# EAGLE design BrickPi 0_7 (EAGLE 6.3)
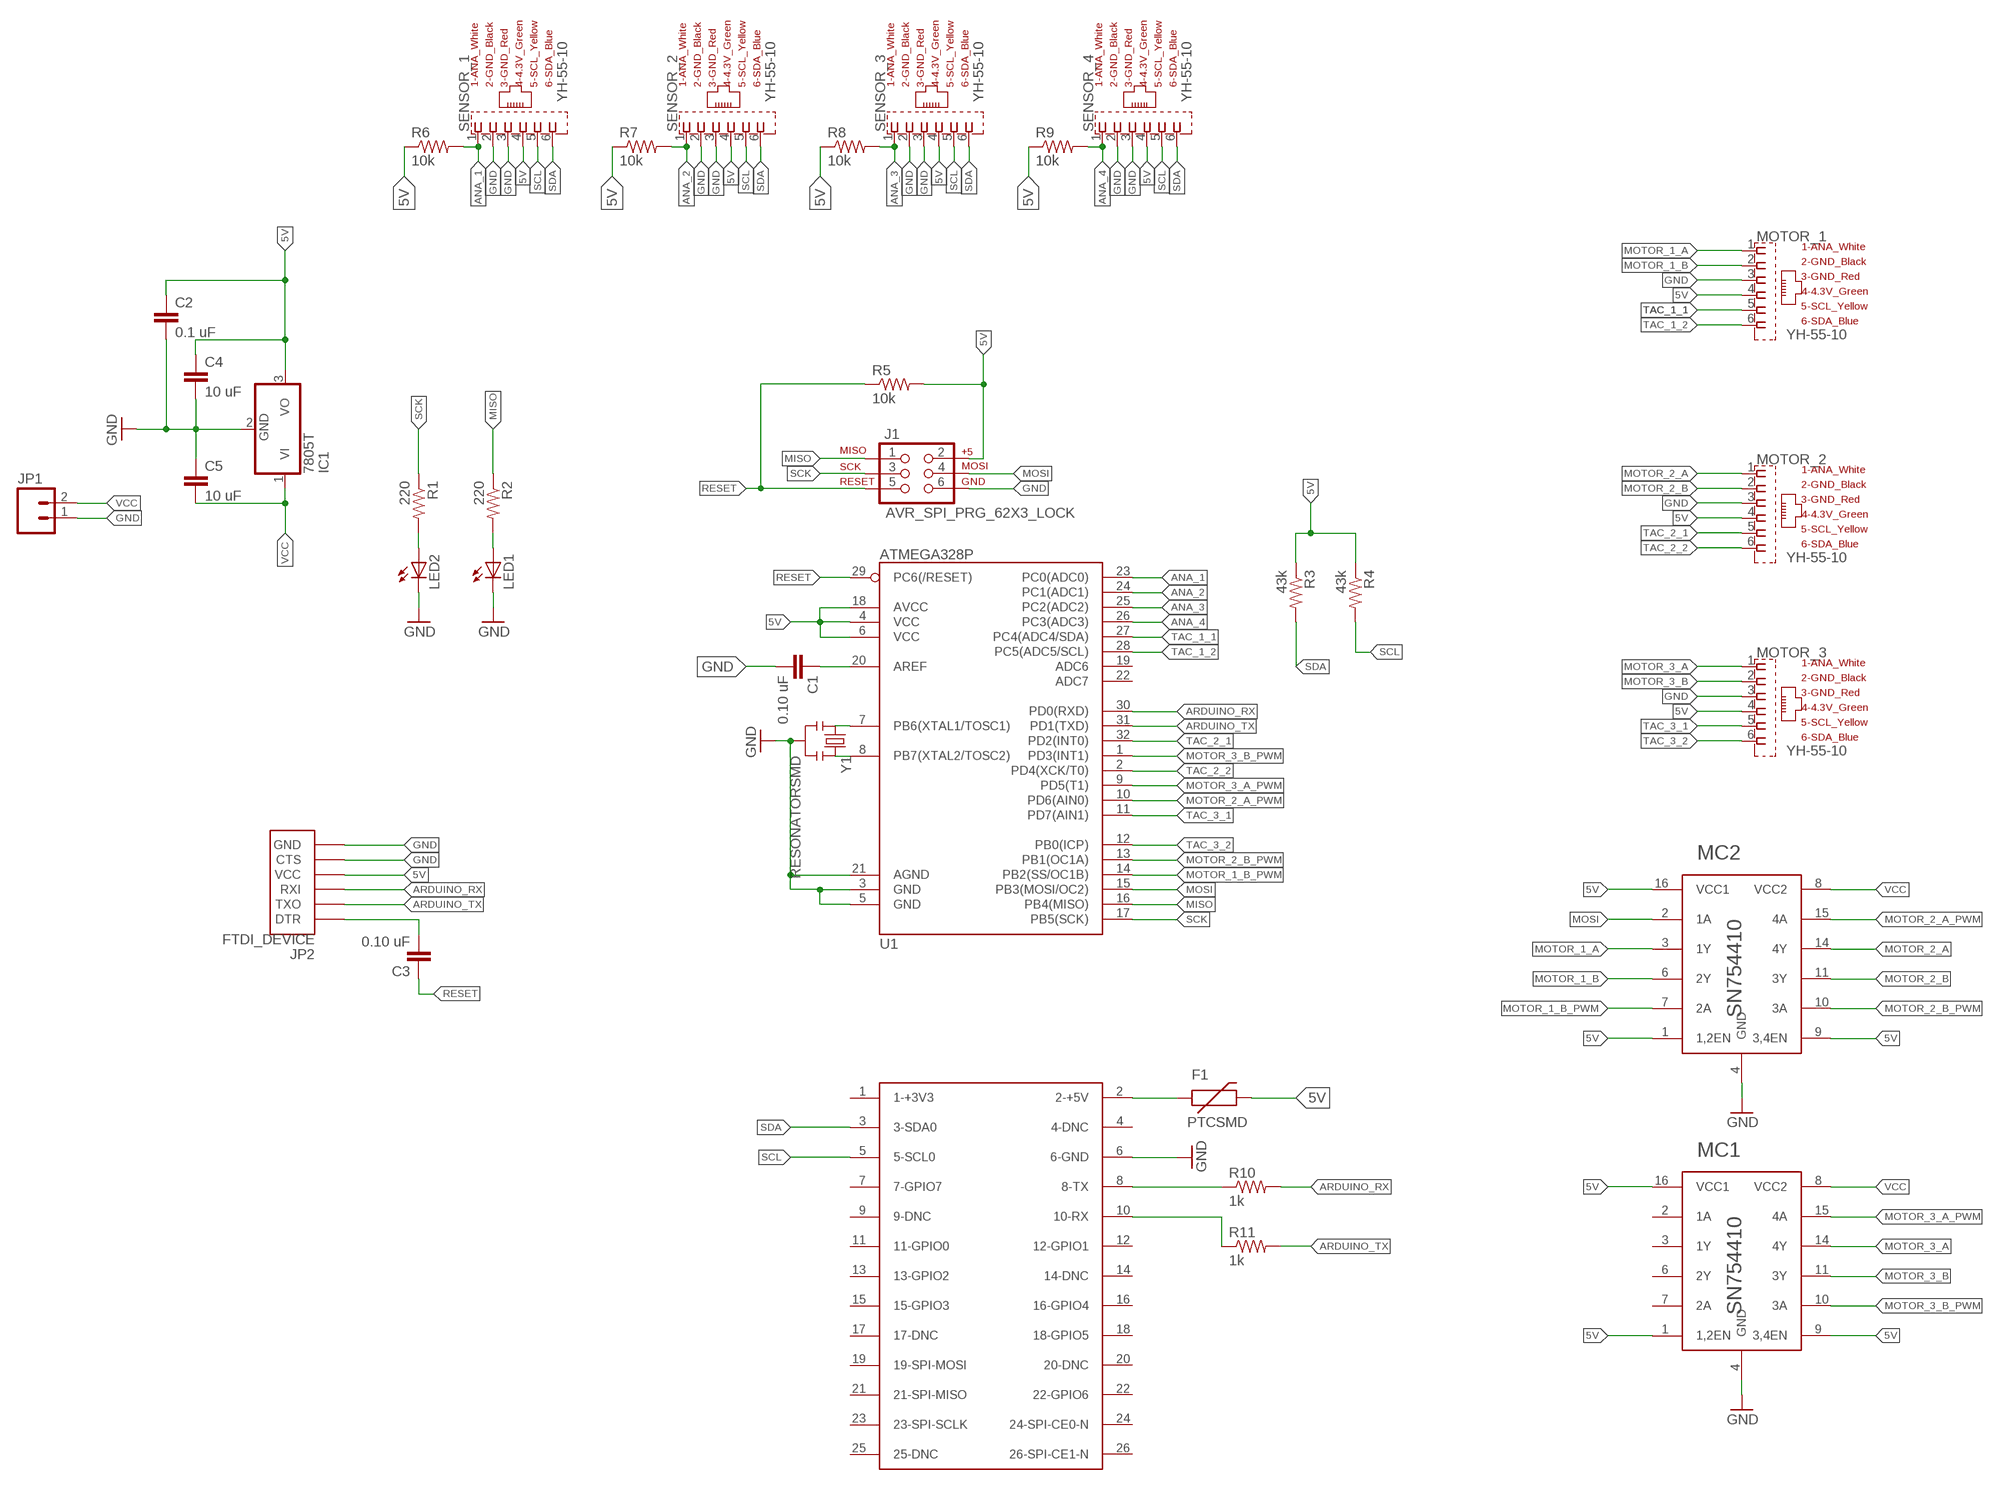
[diagram p0: schematic, sheet 1]

## Parts
C1  0.10 uF  CAP0805  [0805]
C2  0.1 uF  CAP0805  [0805]
C3  0.10 uF  CAP0805  [0805]
C4  10 uF  CAP0805  [0805]
C5  10 uF  CAP0805  [0805]
F1  PTCSMD  [PTC-1206]
IC1  7805T  [TO220H]
J1  AVR_SPI_PRG_62X3_LOCK  [2X3_LOCK]
JP1  M02LOCK  [1X02_LOCK]
JP2  FTDI_DEVICE  [FTDI_DEVICE_SIDE]
LED1  LED1206  [LED-1206]
LED2  LED1206  [LED-1206]
MC1  SN754410  [DIL16]
MC2  SN754410  [DIL16]
MOTOR_1  YH-55-10  [YH-55-10]
MOTOR_2  YH-55-10  [YH-55-10]
MOTOR_3  YH-55-10  [YH-55-10]
PI_OUTLINE  RASPBERRY-PI  [RASPBERRY-PI]
R1  220  220-5%  [0603-RES]
R2  220  220-5%  [0603-RES]
R3  43k  220-5%  [0603-RES]
R4  43k  220-5%  [0603-RES]
R5  10k  220-5%  [0603-RES]
R6  10k  220-5%  [0603-RES]
R7  10k  220-5%  [0603-RES]
R8  10k  220-5%  [0603-RES]
R9  10k  220-5%  [0603-RES]
R10  1k  220-5%  [0603-RES]
R11  1k  220-5%  [0603-RES]
SENSOR_1  YH-55-10  [YH-55-10]
SENSOR_2  YH-55-10  [YH-55-10]
SENSOR_3  YH-55-10  [YH-55-10]
SENSOR_4  YH-55-10  [YH-55-10]
U1  ATMEGA328P  ATMEGA328_SMT  [TQFP32-08]
Y1  RESONATORSMD  [RESONATOR-SMD]

## Nets
5V [Logic_Power]: C2.1 C4.1 F1.2 IC1.3(VO) J1.2 JP2.P$4(VCC) MC1.1(1,2EN) MC1.9(3,4EN) MC1.16(VCC1) MC2.1(1,2EN) MC2.9(3,4EN) MC2.16(VCC1) MOTOR_1.4(4_4.3V_GREEN) MOTOR_2.4(4_4.3V_GREEN) MOTOR_3.4(4_4.3V_GREEN) R3.1 R4.1 R5.2 R6.1 R7.1 R8.1 R9.1 SENSOR_1.4(4_4.3V_GREEN) SENSOR_2.4(4_4.3V_GREEN) SENSOR_3.4(4_4.3V_GREEN) SENSOR_4.4(4_4.3V_GREEN) U1.4(VCC) U1.6(VCC) U1.18(AVCC)
ANA_1: R6.2 SENSOR_1.1(1_ANA_WHITE) U1.23(PC0(ADC0))
ANA_2: R7.2 SENSOR_2.1(1_ANA_WHITE) U1.24(PC1(ADC1))
ANA_3: R8.2 SENSOR_3.1(1_ANA_WHITE) U1.25(PC2(ADC2))
ANA_4: R9.2 SENSOR_4.1(1_ANA_WHITE) U1.26(PC3(ADC3))
ARDUINO_RX: JP2.P$3(RXI) R10.2 U1.30(PD0(RXD))
ARDUINO_TX: JP2.P$2(TXO) R11.2 U1.31(PD1(TXD))
GND [Power]: C1.2 C2.2 C4.2 C5.1 IC1.2(GND) J1.6 JP1.1 JP2.P$5(CTS) JP2.P$6(GND) LED1.C LED2.C MC1.4(GND) MC2.4(GND) MOTOR_1.3(3_GND_RED) MOTOR_2.3(3_GND_RED) MOTOR_3.3(3_GND_RED) PI_OUTLINE.6(6-GND) SENSOR_1.2(2_GND_BLACK) SENSOR_1.3(3_GND_RED) SENSOR_2.2(2_GND_BLACK) SENSOR_2.3(3_GND_RED) SENSOR_3.2(2_GND_BLACK) SENSOR_3.3(3_GND_RED) SENSOR_4.2(2_GND_BLACK) SENSOR_4.3(3_GND_RED) U1.3(GND) U1.5(GND) U1.21(AGND) Y1.2
MISO: J1.1 R2.1 U1.16(PB4(MISO))
MOSI: J1.4 MC2.2(1A) U1.15(PB3(MOSI/OC2))
MOTOR_1_A [Power]: MC2.3(1Y) MOTOR_1.1(1_ANA_WHITE)
MOTOR_1_B [Power]: MC2.6(2Y) MOTOR_1.2(2_GND_BLACK)
MOTOR_1_B_PWM: MC2.7(2A) U1.14(PB2(SS/OC1B))
MOTOR_2_A [Power]: MC2.14(4Y) MOTOR_2.1(1_ANA_WHITE)
MOTOR_2_A_PWM: MC2.15(4A) U1.10(PD6(AIN0))
MOTOR_2_B [Power]: MC2.11(3Y) MOTOR_2.2(2_GND_BLACK)
MOTOR_2_B_PWM: MC2.10(3A) U1.13(PB1(OC1A))
MOTOR_3_A [Power]: MC1.14(4Y) MOTOR_3.1(1_ANA_WHITE)
MOTOR_3_A_PWM: MC1.15(4A) U1.9(PD5(T1))
MOTOR_3_B [Power]: MC1.11(3Y) MOTOR_3.2(2_GND_BLACK)
MOTOR_3_B_PWM: MC1.10(3A) U1.1(PD3(INT1))
N$1: U1.7(PB6(XTAL1/TOSC1)) Y1.1
N$2: U1.8(PB7(XTAL2/TOSC2)) Y1.3
N$3: LED2.A R1.2
N$4: LED1.A R2.2
N$6 [Logic_Power]: C1.1 U1.20(AREF)
N$14: C3.2 JP2.P$1(DTR)
PI_POWER: F1.1 PI_OUTLINE.2(2-+5V)
RESET: C3.1 J1.5 R5.1 U1.29(PC6(/RESET))
RX_TO_PI: PI_OUTLINE.8(8-TX) R10.1
SCK: J1.3 R1.1 U1.17(PB5(SCK))
SCL: PI_OUTLINE.5(5-SCL0) R4.2 SENSOR_1.5(5_SCL_YELLOW) SENSOR_2.5(5_SCL_YELLOW) SENSOR_3.5(5_SCL_YELLOW) SENSOR_4.5(5_SCL_YELLOW)
SDA: PI_OUTLINE.3(3-SDA0) R3.2 SENSOR_1.6(6_SDA_BLUE) SENSOR_2.6(6_SDA_BLUE) SENSOR_3.6(6_SDA_BLUE) SENSOR_4.6(6_SDA_BLUE)
TAC_1_1: MOTOR_1.5(5_SCL_YELLOW) U1.27(PC4(ADC4/SDA))
TAC_1_2: MOTOR_1.6(6_SDA_BLUE) U1.28(PC5(ADC5/SCL))
TAC_2_1: MOTOR_2.5(5_SCL_YELLOW) U1.32(PD2(INT0))
TAC_2_2: MOTOR_2.6(6_SDA_BLUE) U1.2(PD4(XCK/T0))
TAC_3_1: MOTOR_3.5(5_SCL_YELLOW) U1.11(PD7(AIN1))
TAC_3_2: MOTOR_3.6(6_SDA_BLUE) U1.12(PB0(ICP))
TX_TO_PI: PI_OUTLINE.10(10-RX) R11.1
VCC [Power]: C5.2 IC1.1(VI) JP1.2 MC1.8(VCC2) MC2.8(VCC2)
Unconnected: MC1.2(1A) MC1.3(1Y) MC1.6(2Y) MC1.7(2A) PI_OUTLINE.1(1-+3V3) PI_OUTLINE.4(4-DNC) PI_OUTLINE.7(7-GPIO7) PI_OUTLINE.9(9-DNC) PI_OUTLINE.11(11-GPIO0) PI_OUTLINE.12(12-GPIO1) PI_OUTLINE.13(13-GPIO2) PI_OUTLINE.14(14-DNC) PI_OUTLINE.15(15-GPIO3) PI_OUTLINE.16(16-GPIO4) PI_OUTLINE.17(17-DNC) PI_OUTLINE.18(18-GPIO5) PI_OUTLINE.19(19-SPI-MOSI) PI_OUTLINE.20(20-DNC) PI_OUTLINE.21(21-SPI-MISO) PI_OUTLINE.22(22-GPIO6) PI_OUTLINE.23(23-SPI-SCLK) PI_OUTLINE.24(24-SPI-CE0-N) PI_OUTLINE.25(25-DNC) PI_OUTLINE.26(26-SPI-CE1-N) U1.19(ADC6) U1.22(ADC7)

## Power pins joined to a net without a drawn wire
GND: MC1.5(GND) MC1.12(GND) MC1.13(GND) MC2.5(GND) MC2.12(GND) MC2.13(GND)

## Library data of the parts
C1-C5 = SparkFun:CAP: Capacitor Standard 0603 ceramic capacitor, and 0.1" leaded capacitor.
F1 = SparkFun-PowerIC:PTC: Resettable Fuse PTC Resettable Fuse. Spark Fun Electronics SKU : COM-08357
IC1 = linear:78*: Positive VOLTAGE REGULATOR Source: http://cache.national.com/ds/LM/LM78L05.pdf http://www.fairchildsemi.com/ds/LM/LM7805.pdf
J1 = SparkFun-Connectors:AVR_SPI_PRG_6: AVR ISP 6 Pin This is the reduced ISP connector for AVR programming. Common on Arduino. This footprint will take up less PCB space and can be used with a 10-pin to 6-pin adapter such as SKU: BOB-08508
JP1 = SparkFun-f115009:M02: Header 2 Standard 2-pin 0.1" header. Use with straight break away headers (SKU : PRT-00116), right angle break away headers (PRT-00553), swiss pins (PRT-00743), machine pins (PRT-00117), and female headers (PRT-00115). Molex polarized connector foot print use with SKU : PRT-08233 with associated crimp pins and housings.
JP2 = SparkFun-Connectors:FTDI_DEVICE: Connector which mates to FTDI basic or FTDI cable.
LED1 LED2 = SparkFun-LED:LED: LEDs Standard schematic elements and footprints for 5mm, 3mm, 1206, and 0603 sized LEDs. 5mm - Spark Fun Electronics SKU : COM-00529 (and others)
MC1 MC2 = DualBridge:SN754410: Quad Half-Bridge Driver
MOTOR_1-MOTOR_3 SENSOR_1-SENSOR_4 = DEXTER INDUSTRIES NXT Female Adapter (2!!):YH-55-10: RJ11 6 connects Source:Dexter Industries LEGO MINDSTORMS NXT Female Adapter; OC_FARNELL: unknown; OC_NEWARK: unknown
PI_OUTLINE = RaspberryPi:RASPBERRY-PI: Raspberry Pi Board <http://www.raspberrypi.org/> Jacques Lagnel V1.0 (beta) 2012 Board dimension: Forum 3D model <http://www.raspberrypi.org/forum/general-discussion/mechanical-profile-3d-models?value=3d%20model&type=1&include=1&search=1&ret=all> The GPIO Connector (P1): http://elinux.org/RPi_Low-level_peripherals
R1 R2 = SparkFun-Resistors:220-5%: 220-ohm SMT 1/8W - 5% (0805) RES-07866; PROD_ID: RES-07866
R3-R11 = SparkFun-Resistors:220-5%: 220-ohm SMT 1/8W - 5% (0805) RES-07866; PROD_ID: RES-07866; VALUE: 220
U1 = SparkFun-DigitalIC:ATMEGA328_SMT: 32-Pin Atmega328 part Commonly used on Arduino compatible boards Available in QFP and QFN packages TQFP is IC-09069 QFN is non-stock; PROD_ID: IC-09069
Y1 = SparkFun-f115009:RESONATOR: Resonator Small SMD resonator. This is the itty bitty 10/20MHz resonators with built in caps. CSTCE10M0G55 and CSTCE20M0V53. Footprint has been reviewed closely but hasn't been tested yet.

## Net classes
0 DATA: width 0.254 mm, drill 0.5 mm, clearance 0.152 mm
1 Power: width 0.508 mm, drill 0.6 mm, clearance 0.152 mm
2 Logic_Power: width 0.381 mm, drill 0.6 mm, clearance 0.152 mm

## Board
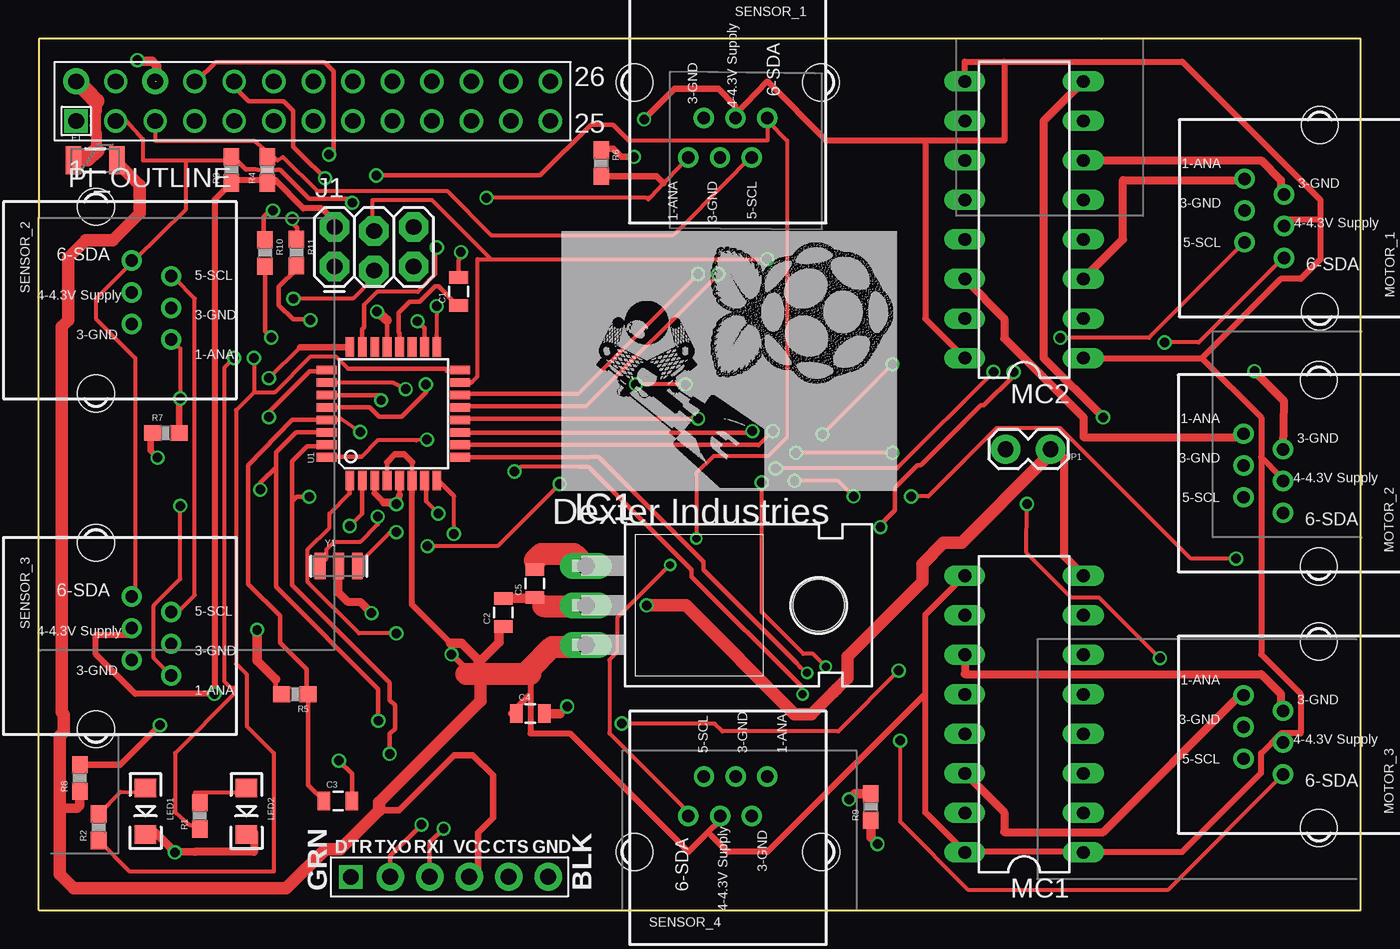
[diagram p1: board, top side]
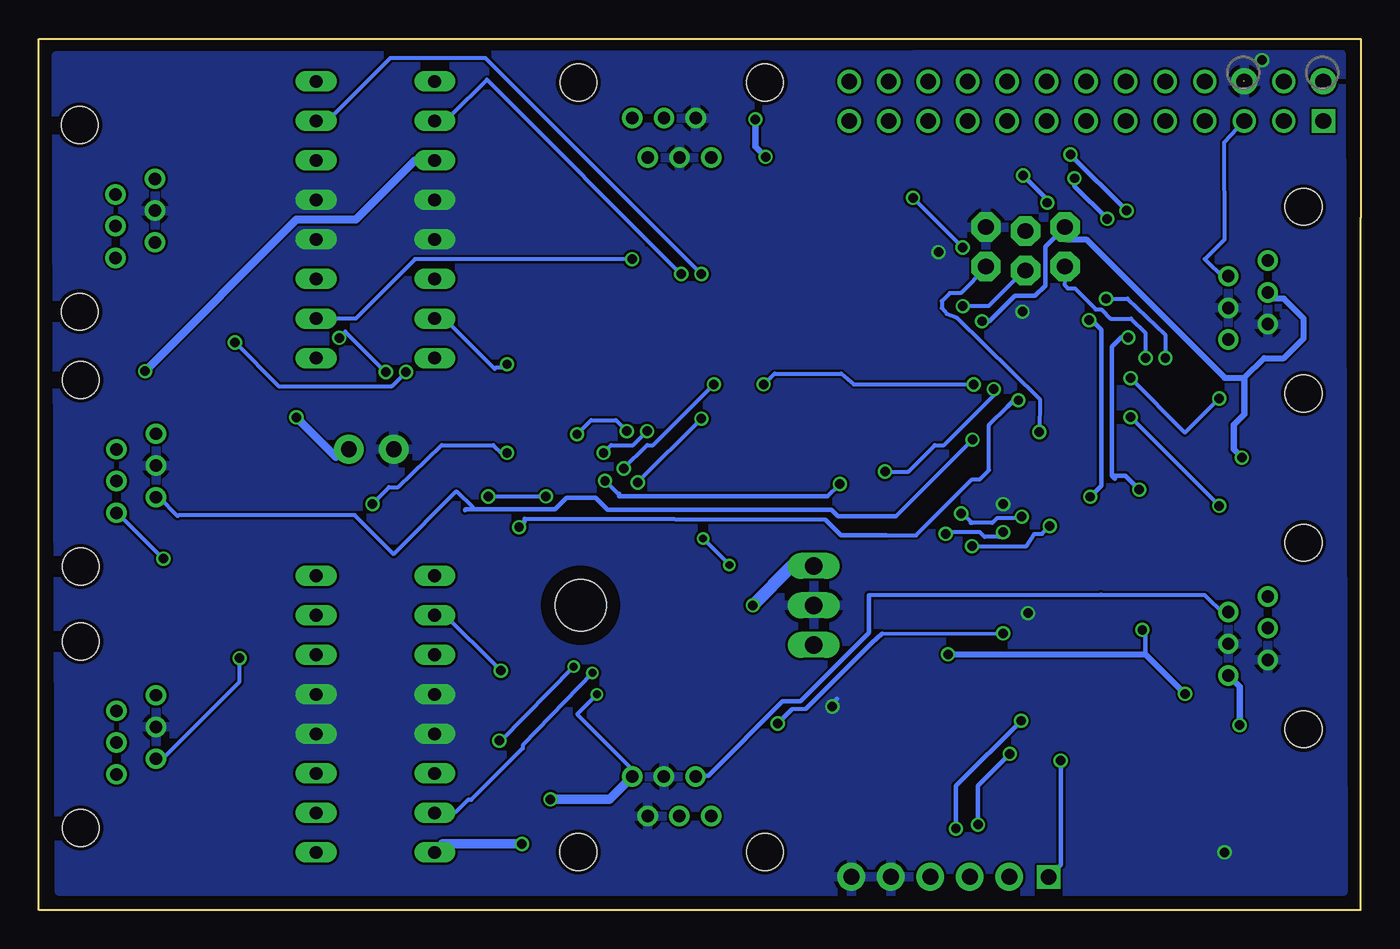
[diagram p2: board, bottom side, seen from below]

Size 85 x 56 mm. Coordinates in mm from the lower left corner, seen from the top.
Copper layers (1*16): Top 0.035mm / dielectric 1.5mm / Bottom 0.035mm
Design rules "Fusion_eagle_rule_v1.1": minimum track width 6mil, minimum drill 12mil, track to track 6mil, track to pad 6mil, pad to pad 6mil, via to via 6mil, smd to smd 0mil, copper to edge 10mil, drill to drill 10mil, minimum pad ring 10mil, minimum via ring 6mil, stop-mask expansion 2mil, vias tented up to drill 100mil, thermal gap 10mil

### Footprints (pad centres in the part's own frame; a part is rotated, then mirrored left to right if it is on the bottom)
0805 = smd 0.8 x 1.2: 1 -0.9,0; 2 0.9,0
PTC-1206 = smd 1 x 1.8: 1 -1.4,0; 2 1.4,0
TO220H = drill 1.118 long: 1 -2.54,-10.16; 2 0,-10.16; 3 2.54,-10.16 | hole 3.302: 0,4.826
2X3_LOCK = drill 1.016 pad 1.88 octagon: 1 0,0; 2 0,2.54; 3 2.54,-0.254; 4 2.54,2.286; 5 5.08,0; 6 5.08,2.54
1X02_LOCK = drill 1.016 pad 1.88: 1 -0.178,0; 2 2.718,0
FTDI_DEVICE_SIDE = drill 1 square: P$1 -6.35,0 | drill 1.016 pad 1.778: P$2 -3.81,0; P$3 -1.27,0; P$4 1.27,0; P$5 3.81,0; P$6 6.35,0
LED-1206 = smd 1.2 x 1.4: A -1.5,0; C 1.5,0
DIL16 = drill 0.813 long: 1 -8.89,-3.81; 2 -6.35,-3.81; 3 -3.81,-3.81; 4 -1.27,-3.81; 5 1.27,-3.81; 6 3.81,-3.81; 7 6.35,-3.81; 8 8.89,-3.81; 9 8.89,3.81; 10 6.35,3.81; 11 3.81,3.81; 12 1.27,3.81; 13 -1.27,3.81; 14 -3.81,3.81; 15 -6.35,3.81; 16 -8.89,3.81
YH-55-10 = drill 0.8 pad 1.3: 1 2.54,4.84; 2 1.54,2.3; 3 0.5,4.84; 4 -0.5,2.3; 5 -1.54,4.84; 6 -2.54,2.3 | hole 2.36: -6,0; 6,0
RASPBERRY-PI = drill 1 square: 1 0,0 | drill 1 pad 1.676: 2 0,2.54; 6 5.08,2.54 | drill 1: 3 2.54,0; 4 2.54,2.54; 5 5.08,0; 7 7.62,0; 8 7.62,2.54; 9 10.16,0; 10 10.16,2.54; 11 12.7,0; 12 12.7,2.54; 13 15.24,0; 14 15.24,2.54; 15 17.78,0; 16 17.78,2.54; 17 20.32,0; 18 20.32,2.54; 19 22.86,0; 20 22.86,2.54; 21 25.4,0; 22 25.4,2.54; 23 27.94,0; 24 27.94,2.54; 25 30.48,0; 26 30.48,2.54
0603-RES = smd 1.1 x 1: 1 -0.85,0; 2 0.85,0
TQFP32-08 = smd 1.27 x 0.559: 1 -4.293,2.8; 2 -4.293,2; 3 -4.293,1.2; 4 -4.293,0.4; 5 -4.293,-0.4; 6 -4.293,-1.2; 7 -4.293,-2; 8 -4.293,-2.8; 17 4.293,-2.8; 18 4.293,-2; 19 4.293,-1.2; 20 4.293,-0.4; 21 4.293,0.4; 22 4.293,1.2; 23 4.293,2; 24 4.293,2.8 | smd 0.559 x 1.27: 9 -2.8,-4.293; 10 -2,-4.293; 11 -1.2,-4.293; 12 -0.4,-4.293; 13 0.4,-4.293; 14 1.2,-4.293; 15 2,-4.293; 16 2.8,-4.293; 25 2.8,4.293; 26 2,4.293; 27 1.2,4.293; 28 0.4,4.293; 29 -0.4,4.293; 30 -1.2,4.293; 31 -2,4.293; 32 -2.8,4.293
RESONATOR-SMD = smd 0.7 x 1.7: 1 -1.2,0; 2 0,0; 3 1.2,0

### Placement (x,y rotation side)
C1  26.99,39.75 90 top
C2  29.86,19.13 90 top
C3  19.24,7.01 0 top
C4  31.61,12.62 0 top
C5  31.89,20.98 90 top
F1  3.62,48.18 0 top
IC1  45.33,19.58 270 top
J1  19.01,41.36 0 top
JP1  62.35,29.62 0 top
JP2  26.4,2.13 0 top
LED1  6.86,6.34 270 top
LED2  13.35,6.34 270 top
MC1  63.36,12.59 90 top
MC2  63.36,44.38 90 top
MOTOR_1  82.37,44.46 90 top
MOTOR_2  82.31,28.07 90 top
MOTOR_3  82.31,11.26 90 top
PI_OUTLINE  2.4,50.73 0 top
R1  10.34,6.05 90 top
R2  3.85,5.32 90 top
R3  12.39,47.59 90 top
R4  14.69,47.59 90 top
R5  16.47,13.87 180 top
R6  36.16,48.01 270 top
R7  8.17,30.66 0 top
R8  2.63,8.48 90 top
R9  53.5,6.63 90 top
R10  14.54,42.24 270 top
R11  16.57,42.27 270 top
SENSOR_1  44.3,53.2 180 top
SENSOR_2  3.67,39.2 270 top
SENSOR_3  3.67,17.61 270 top
SENSOR_4  44.31,3.73 0 top
U1  22.8,31.91 90 top
Y1  19.28,22.1 0 top

### Tracks (layer width: path | path; a pad name or v marks a point on that pad's centre or on a via)
5V  (via drill 0.6, 0.61)
  Top 0.305: 23.99,28.78 23.99,27.86 U1.6 | v24.35,37.85 24.8,37.39 U1.18 | 22.39,28.78 U1.4 | 15.23,14.83 15.23,14.26 R5.2
  Top 0.381: 15.23,46.91 12.56,46.91 | 15.23,46.91 17,45.11 18.2,45.11 18.91,44.38 J1.2 | 15.23,46.91 R4.1 | 12.56,46.91 11.29,45.64 v11.29,13.89 6.21,13.89 3.67,16.43 3.67,17.7 6.21,17.7 SENSOR_3.4 | 12.56,46.91 R3.1 | 26.48,17.15 23.99,19.63 23.99,27.86 U1.6 | 31.61,13.89 30.34,12.62 C4.1 | 31.61,15.16 31.61,13.89 | 43.04,5 41.77,3.73 34.15,11.35 31.61,11.35 31.61,13.89 | 43.04,5 43.8,5.74 SENSOR_4.4 | 79.87,11.35 78.6,10.08 78.6,8.81 73.52,3.73 67.17,3.73 | 67.17,3.73 59.55,3.73 | 67.17,3.73 MC1.1 | 57.01,13.89 57.01,6.27 59.55,3.73 | 57.01,13.89 57.01,18.97 59.55,21.51 MC1.9 | 59.55,3.73 MC1.16 | 78.6,29.13 79.87,27.86 MOTOR_2.4 | 78.6,29.13 78.6,31.67 74.79,35.48 | MC2.1 74.79,35.48 | 82.41,44.38 79.87,44.38 MOTOR_1.4 | 82.41,44.38 82.41,45.64 73.52,54.53 62.09,54.53 | 62.09,54.53 59.55,54.53 MC2.9 | 57.01,49.45 62.09,49.45 62.09,54.53 | 57.01,49.45 50.66,49.45 46.85,53.27 44.77,51.11 SENSOR_1.4 | MC2.16 57.01,38.02 57.01,49.45 | 74.79,35.48 79.87,40.56 81.14,40.56 82.41,41.84 82.41,44.38 | 79.87,11.35 81.14,11.35 81.14,13.89 78.6,16.43 78.6,29.13 | 79.87,11.35 MOTOR_3.4 | 43.04,5 44.28,3.73 46.85,3.73 57.01,13.89
  Top 0.406: 22.39,28.78 22.89,29.28 23.49,29.28 23.99,28.78 | U1.6 | v26.53,16.43 26.55,16.43 27.82,15.16 | 44.77,51.11 44.77,51.72 43.7,52.78 40.88,52.78 v38.92,50.83 | v38.27,48.41 37.48,48.41 36.97,48.92 36.22,48.92 R6.1 | v7.63,29.08 7.61,29.08 7.18,29.52 7.18,30.52 R7.1 | 21.88,6.43 23.18,6.43 26.71,9.96 27.9,9.96 29.2,8.66 29.2,5.94 28.23,4.98 28.23,2.69 JP2.P$4
  Top 0.61: R8.1 2.63,6.71 2.45,6.53 1.36,6.53 1.33,6.55 | 26.48,17.15 27.19,17.15 28.26,16.08 | 28.26,16.08 28.26,15.19 28.23,15.16 | 28.26,16.08 28.46,16.08 29.6,17.22 29.6,17.97 C2.1 | R9.1 53.5,4.67 v53.94,4.24 | v14.03,18.01 14.03,16.03 15.23,14.83
  Top 0.813: F1.2 5.02,48.05 6.49,46.59 6.49,44.81 4.74,43.05 3.01,43.05 1.89,41.94 1.89,37.92 1.46,37.49 1.46,12.7 1.61,12.55 1.61,11.46 1.33,11.18 1.33,6.55 1.33,2.31 2.25,1.4 15.91,1.4 18.43,3.91 19.37,3.91 21.88,6.43 21.88,6.93 28.41,13.46 28.41,15.16
  Top 1.422: IC1.3 35.04,16.92 33.01,16.92 31.61,15.52 31.61,15.16 28.41,15.16 28.23,15.16 27.82,15.16 27.48,15.16
  Bottom 0.305: v24.35,37.85 23.86,37.85 22.24,39.47 20.94,39.47 20.28,40.13 20.28,42.63 J1.2 | 13.83,16.43 13.83,17.81 v14.03,18.01
  Bottom 0.381: SENSOR_2.4 6.21,39.29 4.94,39.29 3.67,38.02 3.67,36.75 4.94,35.48 6.21,35.48 7.48,34.21 8.75,34.21 17.64,43.1 18.91,43.1 J1.2 | v11.29,13.89 13.83,16.43 v26.53,16.43
  Bottom 0.406: v38.92,50.83 38.92,49.07 v38.27,48.41 | 7.48,34.21 7.48,31.88 8.17,31.19 8.17,29.62 v7.63,29.08
  Bottom 0.61: v53.94,4.24 59.04,4.24 59.17,4.12 59.17,4.09 MC1.16
ANA_1  (via drill 0.61)
  Top 0.254: 20.91,38.9 21.75,39.74 24.37,39.74 25.49,40.88 25.49,42.48 v25.59,42.59 | v28.79,45.78 39.09,45.78 39.19,45.68 39.19,45.78 39.29,45.78 40.17,46.7 41.29,47.88 41.69,48.28 SENSOR_1.1
  Top 0.305: 20.91,38.9 20.91,37.46 20.79,37.34 20.79,36.21 U1.23
  Top 0.406: R6.2 39.71,47.16 40.17,46.7
  Bottom 0.254: v28.79,45.78 v25.59,42.59
ANA_2  (via drill 0.61)
  Top 0.254: v14.79,34.18 16.79,36.18 | v9.09,32.88 9.09,36.09 SENSOR_2.1 | U1.24
  Top 0.406: R7.2 9.02,32.81 v9.09,32.88 | 16.79,36.18 19.99,36.18 U1.24
  Bottom 0.254: v14.79,34.18 11.29,30.68 v9.09,32.88
ANA_3  (via drill 0.6, 0.61)
  Top 0.254: v9.09,25.98 9.09,21.28 7.39,19.58 7.39,16.18 8.49,15.08 SENSOR_3.1
  Top 0.305: v14.79,31.68 14.79,32 17.41,34.62 18.42,34.62 U1.25
  Top 0.406: R8.2 5.23,9.33 v7.79,11.89
  Bottom 0.254: v9.09,25.98 v14.79,31.68
  Bottom 0.406: v7.79,11.89 7.79,14.35 SENSOR_3.1
ANA_4  (via drill 0.5, 0.6, 0.61)
  Top 0.254: v23.59,33.48 22.79,33.88 18.59,33.88 U1.26 | 34.69,28.48 30.99,28.48 v30.59,28.18 | v49.11,13.86 49.01,14.4
  Top 0.305: 34.69,28.48 35.36,28.48 41.97,21.87 41.97,21.41 49.01,14.4 48.96,14.4
  Top 0.61: R9.2 52.47,7.48 v52.11,7.11
  Bottom 0.254: v30.59,28.18 29.09,28.18 27.39,29.88 26.79,29.88 23.59,33.09 v23.59,33.48 | 46.79,9.08 46.79,8.58 SENSOR_4.1 46.89,9.08 50.39,12.58 v49.11,13.86
  Bottom 0.61: v52.11,7.11 48.31,7.11 SENSOR_4.1
ARDUINO_RX  (via drill 0.6)
  Top 0.305: JP2.P$3 25.13,4.34 v26.02,5.23 | v21.83,12.17 21.83,14.2 15.25,20.78 15.25,28.47 | 15.25,28.47 15.25,29.41 16.55,30.71 U1.30 | R10.2 14.54,37.21 v14.95,36.81 | v14.24,27.03 14.24,27.46 15.25,28.47
  Bottom 0.305: v26.02,5.23 26.02,7.98 v21.83,12.17 | v14.95,36.81 15.38,36.81 15.99,36.2 15.99,27.92 | 15.99,27.92 15.81,27.74 | 15.99,27.92 15.12,27.92 v14.24,27.03
ARDUINO_TX  (via drill 0.6)
  Top 0.305: JP2.P$2 22.59,3.48 v24.6,5.49 | v22.57,10.03 22.57,11.33 22.9,11.66 22.9,13.16 22.57,13.49 22.57,14.61 16.29,20.88 16.29,26.29 | 16.29,26.29 16.29,28.86 17.26,29.82 18.42,29.82 U1.31 | R11.2 16.57,41.2 15.43,40.06 15.43,38.89 16.34,37.97 17.41,37.97 v17.46,37.92 | v17.39,26.57 16.57,26.57 16.29,26.29
  Bottom 0.305: v24.6,5.49 24.6,8 v22.57,10.03 | v17.46,37.92 17.28,37.92 16.68,37.31 16.68,27.28 v17.39,26.57
GND  (via drill 0.6, 0.61)  (1 unrouted)
  Top 0.305: 23.19,26.68 23.19,27.58 | C1.2 26.99,41.73 v27.14,42.29 | 33.52,12.62 v33.97,13.08 | 22.39,37.9 22.39,36.21 U1.21 | 21.59,27.58 21.59,26.78
  Top 0.406: v22.99,26.08 23.19,26.68 | 22.19,26.18 21.59,26.78
  Top 0.508: LED1.C 7.48,5 v8.75,3.7 10.02,3.73 13.83,3.73 13.83,5 LED2.C | 23.19,27.58 U1.5 | 22.19,26.18 22.59,26.18 v22.99,26.08 | 21.59,27.58 U1.3 | v21.39,19.08 20.69,19.78 19.89,19.78 19.29,20.38 19.29,22.28 19.19,22.18 Y1.2
  Top 0.61: v21.75,38.46 22.39,37.9 | C4.2 33.52,12.62 | C2.2 31.83,20.03 C5.1 | 6.67,54.56 7.3,54.56 7.58,54.28 7.58,53.34 7.53,53.29
  Top 0.813: C5.1 32.45,19.53
  Top 1.422: 32.45,19.53 35.11,19.53 IC1.2
  Bottom 0.305: v27.14,42.29 27.01,42.32 27.19,42.49 | v33.97,13.08 33.97,13.28 33.67,13.59
  other vias: 6.34,54.64
  pour Bottom: 1.23,55 83.88,54.91 83.68,1.19 1.13,1.19
MISO  (via drill 0.61)
  Top 0.254: v13.83,35.48 13.83,33.28 | 13.83,33.28 12.69,32.14 12.69,15.82 13.37,15.14 13.37,11.81 15.1,10.08 15.1,2.46 5.85,2.46 R2.1 | 19.89,34.78 19.09,35.59 17.49,35.59 15.19,33.28 13.83,33.28 | 27.09,34.78 U1.16
  Top 0.305: 19.89,34.78 26.11,34.78 26.23,34.67 27.06,34.67 U1.16
  Bottom 0.254: v13.83,35.48 13.86,37.11 14.77,38.02 16.09,38.02 16.68,38.61 17.03,38.61 18.38,39.95 18.83,39.95 19.04,40.21 19.01,40.51 J1.1
MOSI  (via drill 0.61)
  Top 0.254: 29.07,41.84 28.19,41.84 28.19,34.28 27.89,33.98 | 29.07,41.84 v46.85,41.84 | 29.07,41.84 25.26,45.64 21.45,45.64 21.45,44.38 J1.4
  Top 0.305: U1.15 27.81,33.91 27.89,33.98
  Bottom 0.254: MC2.2 64.63,38.02 60.82,41.84 v46.85,41.84
MOTOR_1_A
  Top 0.508: MC2.3 69.71,43.1 69.71,46.91 77.33,46.91 MOTOR_1.1
MOTOR_1_B
  Top 0.508: MC2.6 78.6,48.18 79.87,46.91 79.87,45.64 MOTOR_1.2
MOTOR_1_B_PWM  (via drill 0.61)
  Top 0.254: v42.39,40.88 34.69,33.18 | 27.19,33.18 U1.14
  Top 0.305: 27.19,33.18 34.69,33.18
  Bottom 0.254: v42.39,40.88 56.29,54.78 62.39,54.78 66.09,51.09 66.79,51.09 67.09,50.78 MC2.7
MOTOR_2_A
  Top 0.508: MC2.14 62.09,38.02 62.09,36.75 67.17,31.67 67.17,30.41 77.33,30.41 MOTOR_2.1
MOTOR_2_A_PWM  (via drill 0.6, 0.61)
  Top 0.254: v47.19,30.78 46.29,29.88 | v54.89,35.09 v50.39,30.59
  Top 0.305: U1.10 46.27,29.91 46.29,29.88
  Bottom 0.254: v47.19,30.78 47.89,31.48 49.49,31.48 v50.39,30.59 | v54.89,35.09 54.89,34.98 54.79,34.88 55.59,34.88 55.69,34.78 59.19,38.28 59.49,37.98 MC2.15
MOTOR_2_B  (via drill 0.6)
  Top 0.508: v78.17,34.64 80.07,32.73 MOTOR_2.2
  Bottom 0.508: v78.17,34.64 68.44,44.38 64.63,44.38 60.82,48.18 MC2.11
MOTOR_2_B_PWM  (via drill 0.61)
  Top 0.254: v43.69,40.88 35.19,32.38 | 27.19,32.38 U1.13
  Top 0.305: 27.19,32.38 35.19,32.38
  Bottom 0.254: v43.69,40.88 56.19,53.38 58.49,51.09 59.19,51.09 MC2.10
MOTOR_3_A
  Top 0.508: MOTOR_3.1 77.33,13.89 68.44,5 62.09,5 62.09,6.27 59.55,8.81 MC1.14
MOTOR_3_A_PWM  (via drill 0.5)
  Top 0.254: v49.4,15.25 48.96,15.62
  Top 0.305: 48.96,15.62 48.75,15.85 42.73,21.87 42.73,22.38 35.98,29.13 35.5,29.13 35.47,29.1 U1.9
  Bottom 0.254: MC1.15 59.55,6.27 58.28,6.27 58.19,6.28 57.39,7.08 57.19,7.08 53.89,10.38 53.89,10.58 v49.4,15.25
MOTOR_3_B
  Top 0.508: MOTOR_3.2 79.87,12.62 79.87,13.89 78.6,15.16 59.55,15.16 MC1.11 59.55,16.43
MOTOR_3_B_PWM  (via drill 0.61)
  Top 0.254: 19.99,26.78 18.69,25.48 18.69,24.58 17.29,23.18 17.29,21.08 20.59,17.78 v22.99,17.78 | v37.49,11.98 43.45,11.98 43.95,11.48 51.41,11.48 v55.29,15.38 | 19.99,27.58 U1.1
  Top 0.305: 19.99,27.58 19.99,26.78
  Bottom 0.254: 30.78,17.76 v22.99,17.78 | v55.29,15.38 59.19,19.28 59.49,18.98 MC1.10
  Bottom 0.305: 30.78,17.76 31.44,17.17 35.67,12.93 36.57,12.9 v37.49,11.98
N$1  (via drill 0.61)
  Top 0.254: v25.69,25.48 24.89,26.28 | v21.79,25.28 21.79,24.78 20.69,23.68 18.99,23.68 18.49,23.18 18.49,22.58 18.09,22.18 Y1.1 | 24.89,27.58 U1.7
  Top 0.305: 24.89,27.58 24.89,26.28
  Bottom 0.254: 24.99,24.88 23.69,24.88 23.39,25.18 21.89,25.18 v21.79,25.28 | 25.09,24.88 24.99,24.88 | 24.99,24.88 25.59,25.48 v25.69,25.48
N$2  (via drill 0.61)
  Top 0.254: v26.69,24.18 26.69,26.58 | v22.99,24.28 22.59,24.28 20.49,22.18 Y1.3
  Top 0.305: U1.8 25.66,27.61 26.69,26.58
  Bottom 0.254: v26.69,24.18 26.39,24.18 26.29,24.28 24.49,24.28 24.19,23.98 23.29,23.98 v22.99,24.28
N$3
  Top 0.254: R1.2 10.02,7.54 13.83,7.54 LED2.A
N$4
  Top 0.254: R2.2 5.25,7.57 6.21,7.54 LED1.A
N$6
  Top 0.305: C1.1 26.92,38.85 25.69,40.08 25.49,40.08 24.5,39.09 23.84,39.09 23.13,38.38 23.13,37.16 23.2,37.08 U1.20
N$14  (via drill 0.6)
  Top 0.305: C3.2 20.14,8.75 v19.29,9.6
  Bottom 0.305: v19.29,9.6 19.29,2.9 JP2.P$1
PI_POWER
  Top 0.61: PI_OUTLINE.2 2.45,53.27 | 3.7,51.36 3.7,49.96 | 2.35,48.31 F1.1
  Top 0.711: 3.7,51.99 3.7,51.36 | 3.7,49.96 3.7,48.82
  Top 1.016: 2.45,53.27 3.7,51.99 | 3.7,48.82 3.11,48.31 2.35,48.31
RESET  (via drill 0.61)
  Top 0.254: v20.66,30.72 19.39,31.59
  Top 0.305: 19.39,31.59 19.31,31.5 U1.29 16.28,31.5 13.45,28.6 13.47,20.93 15.51,18.92 15.51,17.17 17.21,15.47 17.21,13.98 R5.1 17.32,8.03 C3.1
  Bottom 0.254: v20.66,30.72 20.64,32.84 26,38.1 26.61,38.33 26.94,38.71 26.94,39.14 26.43,39.65 25.72,39.65 24.09,41.28 J1.5
RX_TO_PI  (via drill 0.6)
  Top 0.305: PI_OUTLINE.8 10.12,53.27 11.37,54.51 18.38,54.51 18.96,53.92 18.96,48.87 v18.66,48.57 | v15.05,44.96 14.85,44.96 14.46,44.58 14.46,43.17 R10.1
  Bottom 0.305: v18.66,48.57 v15.05,44.96
SCK  (via drill 0.6, 0.61)
  Top 0.254: v12.56,35.48 11.93,34.85 11.93,14.71 12.33,14.3 12.54,14.3 12.56,13.89 8.75,10.08 8.75,6.27 9.62,5.5 R1.1 | v16.37,39.29 20.2,39.29 21.45,40.56 J1.3 | v25.59,38.82 25.59,36.98
  Top 0.305: 25.59,36.98 25.59,36.21 U1.17
  Bottom 0.254: v16.37,39.29 15,39.29 12.56,36.98 v12.56,35.48 | v25.59,38.82 23.93,38.82 21.78,40.97 21.49,41.09 J1.3
SCL
  Top 0.254: 15.35,48.18 13.83,49.45 7.48,49.45 PI_OUTLINE.5 | 15.35,48.18 15.68,48.41 17.89,46.23 26.25,46.23 29.09,43.38 40.79,43.38 40.99,43.59 44.31,46.91 45.58,48.18 SENSOR_1.5 | 15.35,48.18 R4.2 | SENSOR_2.5 8.75,40.56 10.02,39.29 10.02,20.24 8.95,19.17 SENSOR_3.5
  Bottom 0.254: 16.69,20.24 10.02,20.24 8.75,18.97 SENSOR_3.5 | 16.69,20.24 31.61,20.24 | 43.04,8.81 SENSOR_4.5 | PI_OUTLINE.5 8.78,49.35 8.75,43.1 10.02,41.84 8.75,40.56 SENSOR_2.5 | 16.69,20.28 16.69,20.24
  Bottom 0.305: 31.61,20.24 31.61,17.83 36.03,13.41 37.17,13.41 41.95,8.64 42.71,8.64 SENSOR_4.5
SDA  (via drill 0.5, 0.6)
  Top 0.254: 9.46,48.18 6.69,48.18 6.69,49.56 5.63,50.73 PI_OUTLINE.3 | 9.46,48.18 12.56,48.18 R3.2 | 6.21,41.84 3.67,39.29 3.67,38.02 6.21,35.48 6.21,20.24 SENSOR_3.6 | 6.21,41.84 9.46,45.06 9.46,48.18 | 6.21,41.84 SENSOR_2.6 | 46.85,50.73 48.12,49.45 48.12,30.41 46.9,29.18 43.39,29.18 42.24,28.03 42.29,27.98 v42.29,23.88 | SENSOR_4.6 41.77,6.27 36.69,11.35 36.69,11.38 36.69,16.08 37.19,16.58 37.19,18.78 v40.59,22.18 | 37.96,49.45 46.85,49.45 46.85,50.73 | 46.85,50.73 SENSOR_1.6 | 14.06,47.6 15.35,47.6
  Top 0.305: 12.56,48.18 12.71,48.18 13.32,47.6 13.35,47.63 13.91,47.63 14.06,47.6 | 15.35,47.6 15.53,47.6 17.39,45.72 19.9,45.72 v20.16,45.47 | v21.7,47.22 32.22,47.22 35.5,50.5 36.92,50.5 37.96,49.45
  Bottom 0.254: v42.29,23.88 v40.59,22.18
  Bottom 0.305: v20.16,45.47 20.16,45.67 v21.7,47.22
TAC_1_1  (via drill 0.6, 0.61)
  Top 0.254: v65.69,36.78 71.39,36.78 MOTOR_1.5
  Top 0.305: v62.69,34.59 62.69,34.36 60.77,32.44 60.57,32.44 56.73,28.6 56.5,28.6 55.05,27.15 55.05,25.71 54.11,24.77 v54.11,24.61 | U1.27 21.97,33.1 21.97,32.81 v22.01,32.77
  Bottom 0.254: 22.49,32.59 22.73,32.34 23.89,31.18 23.89,28.28 24.49,27.68 24.99,27.68 28.59,24.08 30.49,24.08 | v62.69,34.59 65.29,37.18 v65.69,36.78
  Bottom 0.305: 30.49,24.08 33.42,24.08 34.43,25.1 53.76,25.15 53.76,24.97 v54.11,24.61 | v22.01,32.77 22.31,32.77 22.73,32.34
TAC_1_2  (via drill 0.6, 0.61)
  Top 0.254: v24.89,33.78 24.89,33.27 | v41.59,33.78 v38.39,33.78 | v47.39,28.38 55.19,28.38 v61.39,34.59 | v72.39,36.48 74.59,36.48 79.99,41.88 MOTOR_1.6
  Top 0.305: U1.28 21.28,32.3 21.88,31.7 23.32,31.7 24.89,33.27
  Bottom 0.254: v38.39,33.78 37.69,34.48 33.39,34.48 32.59,33.78 v24.89,33.78 | v41.59,33.78 45.49,29.88 45.89,29.88 v47.39,28.38 | v61.39,34.59 62.29,33.68 69.59,33.68 v72.39,36.48
TAC_2_1  (via drill 0.61)
  Top 0.254: v24.96,30.23 24.29,30.18 21.79,30.18 20.74,29.13 | 18.91,29.13 U1.32
  Top 0.305: 18.91,29.13 20.74,29.13
  Bottom 0.254: 29.87,25.32 v24.96,30.23 | MOTOR_2.5 77.33,26.59 76.06,25.32 75.99,25.38 64.69,25.38 62.19,22.88 58.19,26.88 58.09,26.88 57.09,25.88 57.09,25.76
  Bottom 0.305: 29.87,25.32 33.62,25.32 34.02,25.73 48.42,25.73 49.19,26.49 51.07,26.49 51.8,25.76 57.09,25.76 57.54,25.76 57.59,25.71
TAC_2_2  (via drill 0.6, 0.61)
  Top 0.254: v19.99,24.68 20.79,25.48 | v24.99,23.38 29.49,23.38 v33.49,27.38 | v52.39,26.58 51.39,27.58 v48.59,27.58 | v56.09,26.58 57.19,26.58 61.59,30.98 65.69,30.98 74.09,22.58 v76.99,22.58 | 20.79,27.58 U1.2
  Top 0.305: 20.79,27.58 20.79,25.48
  Bottom 0.254: v19.99,24.68 20.49,24.18 20.99,24.18 21.49,23.38 v24.99,23.38 | v56.09,26.58 v52.39,26.58 | v48.59,27.58 47.69,26.68 | 47.69,26.68 47.69,26.78 | 47.69,26.68 47.69,26.58 | 34.29,26.58 v33.49,27.38 | v76.99,22.58 79.99,25.58 MOTOR_2.6
  Bottom 0.305: 34.29,26.58 47.69,26.58
TAC_3_1  (via drill 0.6, 0.61)
  Top 0.254: v54.89,29.38 v48.69,29.38 | v63.54,26.11 63.52,22.96 66.39,20.08 68.19,20.08 v72.09,16.18 | 27.19,30.68 U1.11
  Top 0.305: 27.19,30.68 45.79,30.68 v45.89,30.78
  Bottom 0.254: v45.89,30.78 46.79,29.88 48.19,29.88 v48.69,29.38 | v54.89,29.38 54.99,29.28 55.19,29.28 55.79,29.88 59.09,29.88 61.89,27.18 62.49,27.18 v63.54,26.11 | v72.09,16.18 72.09,14.68 76.89,9.88 77.29,9.88 77.39,9.78 MOTOR_3.5
TAC_3_2  (via drill 0.5, 0.61)
  Top 0.254: v55.39,10.88 55.39,5.68 59.79,1.28 72.59,1.28 79.99,8.68 MOTOR_3.6 | 27.19,31.59 U1.12 | v50.61,15.64 50.2,16.05 49.8,16.46 49.16,16.46 46.49,19.13 46.49,27.38 v46.49,27.48
  Top 0.305: 27.19,31.59 v42.39,31.59
  Bottom 0.254: v46.49,27.48 v42.39,31.59 | v50.61,15.64 55.29,10.88 v55.39,10.88
TX_TO_PI  (via drill 0.6)
  Top 0.305: PI_OUTLINE.10 12.56,52.93 13.5,51.99 15.73,51.99 16.34,51.38 16.34,49.07 16.85,48.57 16.88,48.57 v18.4,47.04 | v16.29,44.43 16.29,44.17 16.6,43.87 16.6,43.14 R11.1
  Bottom 0.305: v18.4,47.04 18.4,46.53 v16.29,44.43
VCC  (via drill 0.6, 0.61)
  Top 0.508: MC1.8 67.17,21.51 65.9,22.78 65.9,29.13 JP1.2 | MC2.8 64.63,50.73 64.63,35.48 v68.44,31.67 | 64.63,29.13 JP1.2 | 64.59,28.88 JP1.2
  Top 0.813: C5.2 31.89,22.45 | v39.09,19.58 41.61,19.58 48.61,12.58 49.69,12.58 51.09,13.98 51.29,14.18 51.99,14.88 51.99,16.29 56.81,21.1 56.81,22.23 58.18,23.6 59.35,23.6 64.59,28.88
  Top 1.422: 31.89,22.45 32.32,22.89 34.4,22.89 IC1.1
  Bottom 0.508: v68.44,31.67 65.9,29.13 JP1.2 | 35.19,22.08 IC1.1
  Bottom 0.813: 35.19,22.08 36.59,22.08 v39.09,19.58

### Text on the board
tNames: Dexter Industries